# Altium project servo-27.PrjPcb
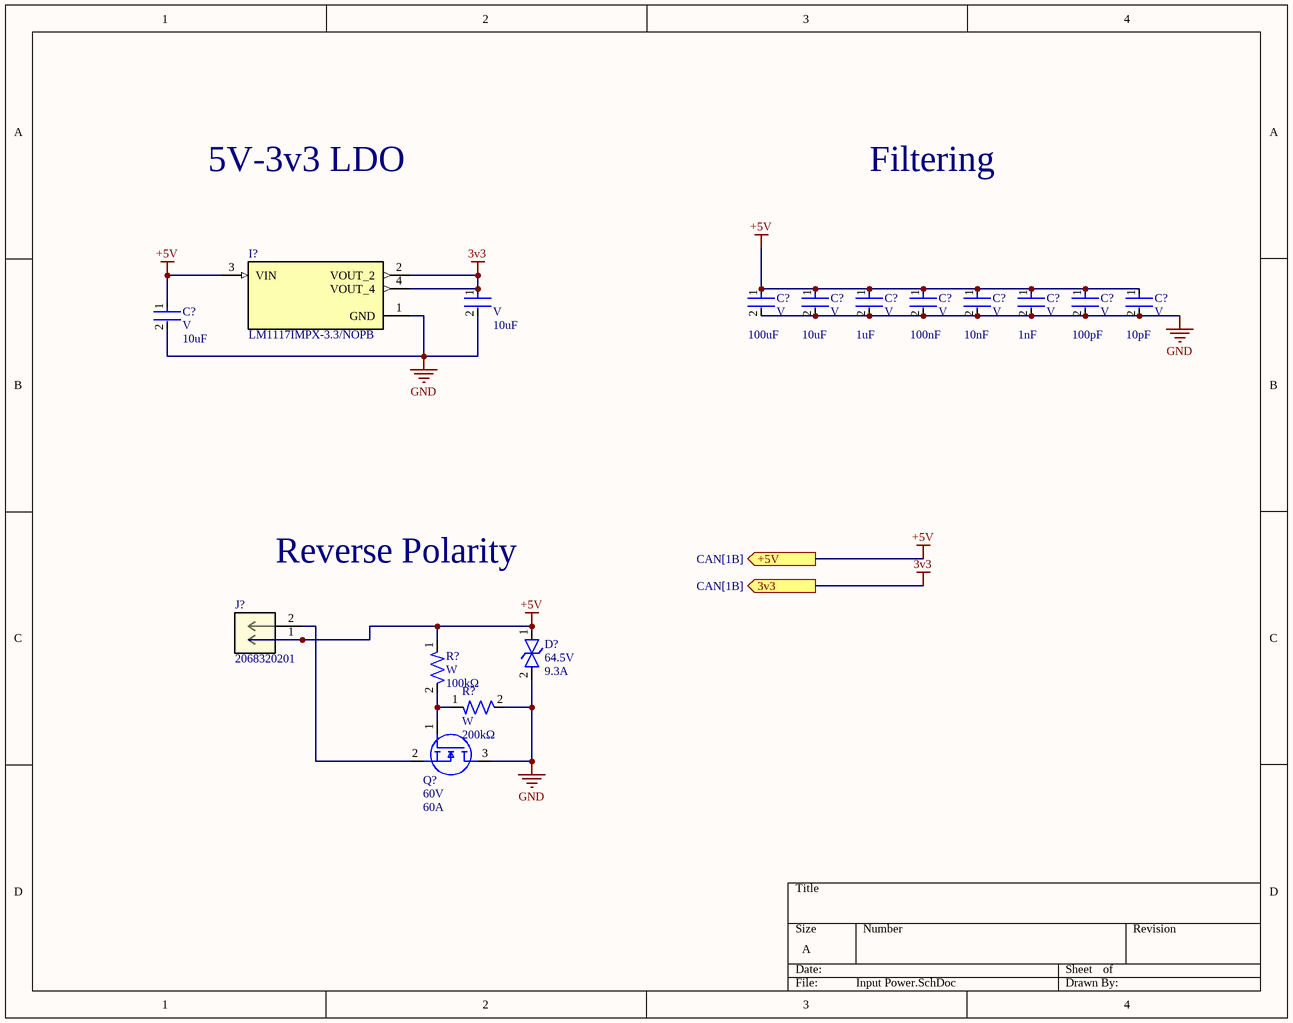
[diagram p0: Input Power.SchDoc]
4 sheets, 32 parts. Net scope: flat (ports and power ports of the same name join across sheets).
Sheets:
  Input Power.SchDoc
  CAN.SchDoc
  MCU.SchDoc
  Headers.SchDoc

## Sheet Input Power.SchDoc
size A; SheetNumber: 1; SheetTotal: 4

### Parts
(Parts that share a designator on the sheet are numbered #1, #2 ... from top to bottom, then left to right.)
?  Voltage Rating: V  Capacitance: 10uF  [CAP-0603]  (hidden comment: CAP 0603)
C?#1  Voltage Rating: V  Capacitance: 100uF  [CAP-0603]  (hidden comment: CAP 0603)
C?#2  Voltage Rating: V  Capacitance: 10uF  [CAP-0603]  (hidden comment: CAP 0603)
C?#3  Voltage Rating: V  Capacitance: 1uF  [CAP-0603]  (hidden comment: CAP 0603)
C?#4  Voltage Rating: V  Capacitance: 100nF  [CAP-0603]  (hidden comment: CAP 0603)
C?#5  Voltage Rating: V  Capacitance: 10nF  [CAP-0603]  (hidden comment: CAP 0603)
C?#6  Voltage Rating: V  Capacitance: 1nF  [CAP-0603]  (hidden comment: CAP 0603)
C?#7  Voltage Rating: V  Capacitance: 100pF  [CAP-0603]  (hidden comment: CAP 0603)
C?#8  Voltage Rating: V  Capacitance: 10pF  [CAP-0603]  (hidden comment: CAP 0603)
C?#9  Voltage Rating: V  Capacitance: 10uF  [CAP-0603]  (hidden comment: CAP 0603)
D?#1  Voltage Rating: 64.5V  Current Rating: 9.3A  [DO-214AA (SMBJ)]  (hidden comment: SMBJ40CA)
I?  LM1117IMPX-3.3/NOPB  [IC-SOT-223-4]
J?#1  2068320201  [CONN_2068320000-SD_02_MOL]
Q?#1  Voltage: 60V  Continuous Current: 60A  [IC-8VSONCLIP]  (hidden comment: CSD18543Q3AT)
R?#1  Wattage: W  Resistance: 100kΩ  [RES-0603]  (hidden comment: RES 0603)
R?#2  Wattage: W  Resistance: 200kΩ  [RES-0603]  (hidden comment: RES 0603)

### Ports
3v3 (out, see CAN[1B]), +5V (out, see CAN[1B])

### Nets
3v3: ?.1 I?.2(VOUT_2) I?.4(VOUT_4) ; port 3v3  [project net VBAT]
+5V: C?#1.1 C?#2.1 C?#3.1 C?#4.1 C?#5.1 C?#6.1 C?#7.1 C?#8.1 C?#9.1 D?#1.1 I?.3(VIN) J?#1.1 R?#1.1 ; port +5V
GND: ?.2 C?#1.2 C?#2.2 C?#3.2 C?#4.2 C?#5.2 C?#6.2 C?#7.2 C?#8.2 C?#9.2 D?#1.2 I?.1(GND) Q?#1.3(D) R?#2.2
NetJ?#1_2: J?#1.2 Q?#1.2(S)
NetQ?#1_1: Q?#1.1(G) R?#1.2 R?#2.1

### Notes on the sheet
- 5V-3v3 LDO
- Filtering
- Reverse Polarity

### Library data of the parts
? C?#9 = CAP 0603: 10u
D?#1 = DIO-TVS-0001: TVS DIODE 40VWM 64.5VC DO214AA; ComponentLink1Description: Datasheet; ComponentLink1URL: https://www.littelfuse.com/media?resourcetype=datasheets&itemid=09a6ae9a-73cb-4ac4-acac-e6dab92ab953&filename=littelfuse_tvs_diode_smbj_datasheet.pdf
I? = IC_LDO_3V3_0001: IC REG LIN 3.3V 800MA SOT223-4; ComponentLink1Description: New link; ComponentLink1URL: https://www.ti.com/lit/ds/symlink/lm1117.pdf?HQS=dis-dk-null-digikeymode-dsf-pf-null-wwe&ts=1721700739746
J?#1 = CONN MF+ 2 PIN VERT: Micro-Fit+ Vertical Header, Through Hole, 3.00mm Pitch, Dual Row, 2 Circuits, Tin (Sn) Plating, Glow-Wire Capable, Black, Tray; Manufacturer_Name: Molex Connector Corporation; Copyright: Copyright (C) 2025 Ultra Librarian. All rights reserved.; Manufacturer_Part_Number: 2068320201; RefDes: RefDes; Type: Type
Q?#1 = NMOS-60A-0001: MOSFET N-CH 60V 12A/60A 8VSON; ComponentLink2Description: Datasheet; ComponentLink2URL: http://www.ti.com/lit/ds/symlink/csd18543q3a.pdf
R?#1 = RES 0603: 100

## Sheet CAN.SchDoc
size A; SheetNumber: 2; SheetTotal: 4
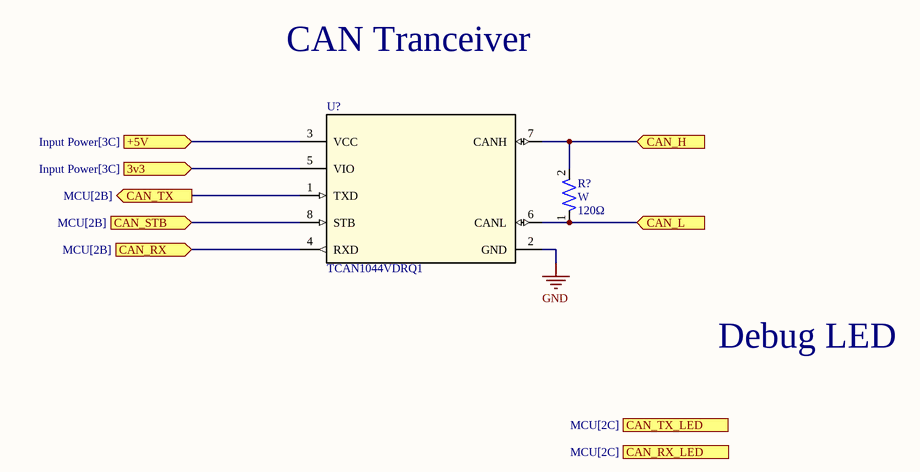
[diagram p1: CAN.SchDoc]

### Parts
(Parts that share a designator on the sheet are numbered #1, #2 ... from top to bottom, then left to right.)
R?#3  Wattage: W  Resistance: 120Ω  [RES-0603]  (hidden comment: RES 0603)
U?#1  TCAN1044VDRQ1  [IC-8SOIC]

### Ports
3v3 (in, see Input Power[3C]), +5V (in, see Input Power[3C]), CAN_H (in), CAN_L (in), CAN_RX (in, see MCU[2B]), CAN_RX_LED (see MCU[2C]), CAN_STB (in, see MCU[2B]), CAN_TX (out, see MCU[2B]), CAN_TX_LED (see MCU[2C])

### Nets
+5V: U?#1.3(VCC) ; port +5V
GND: U?#1.2(GND)
VBAT: U?#1.5(VIO) ; port 3v3
NetR?#3_1: R?#3.1 U?#1.6(CANL) ; port CAN_L
NetR?#3_2: R?#3.2 U?#1.7(CANH) ; port CAN_H
NetU?#1_1: U?#1.1(TXD) ; port CAN_TX
NetU?#1_4: U?#1.4(RXD) ; port CAN_RX
NetU?#1_8: U?#1.8(STB) ; port CAN_STB

### Notes on the sheet
- CAN Tranceiver
- Debug LED

### Library data of the parts
U?#1 = IC-CAN-0001: IC TRANSCEIVER 1/1 8SOIC; ComponentLink1Description: Datasheet; ComponentLink1URL: https://www.ti.com/lit/ds/symlink/tcan1044-q1.pdf?HQS=dis-dk-null-digikeymode-dsf-pf-null-wwe&ts=1728758303289&ref_url=https%253A%252F%252Fwww.ti.com%252Fgeneral%252Fdocs%252Fsuppproductinfo.tsp%253FdistId%253D10%2526gotoUrl%253Dhttps%253A%252F%252Fwww.ti.com%252Flit%252Fgpn%252Ftcan1044-q1

## Sheet MCU.SchDoc
size A; SheetNumber: 3; SheetTotal: 4
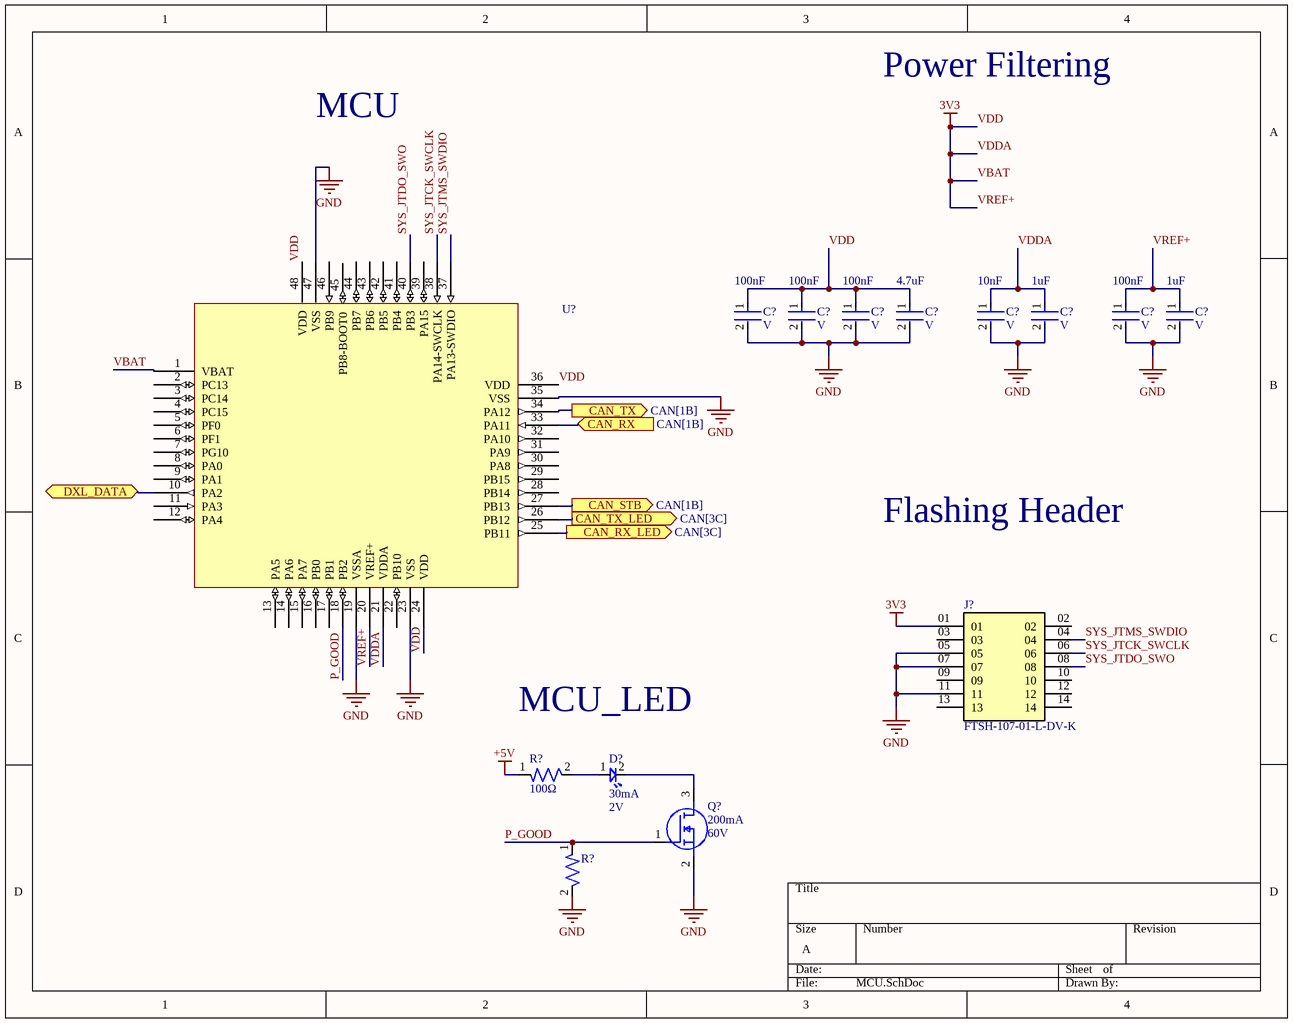
[diagram p2: MCU.SchDoc]

### Parts
(Parts that share a designator on the sheet are numbered #1, #2 ... from top to bottom, then left to right.)
C?#10  Voltage Rating: V  Capacitance: 100nF  [CAP-0603]  (hidden comment: CAP 0603)
C?#11  Voltage Rating: V  Capacitance: 100nF  [CAP-0603]  (hidden comment: CAP 0603)
C?#12  Voltage Rating: V  Capacitance: 100nF  [CAP-0603]  (hidden comment: CAP 0603)
C?#13  Voltage Rating: V  Capacitance: 4.7uF  [CAP-0603]  (hidden comment: CAP 0603)
C?#14  Voltage Rating: V  Capacitance: 10nF  [CAP-0603]  (hidden comment: CAP 0603)
C?#15  Voltage Rating: V  Capacitance: 1uF  [CAP-0603]  (hidden comment: CAP 0603)
C?#16  Voltage Rating: V  Capacitance: 100nF  [CAP-0603]  (hidden comment: CAP 0603)
C?#17  Voltage Rating: V  Capacitance: 1uF  [CAP-0603]  (hidden comment: CAP 0603)
D?#2  Forward Current: 30mA  Forward Voltage: 2V  [LED-0603]  (hidden comment: BL-HKC36G-AV-TRB)
J?#2  FTSH-107-01-L-DV-K  [SAMTEC_FTSH-107-01-L-DV-K]
Q?#2  Continuous Current: 200mA  Voltage: 60V  [IC-SOT23-3]  (hidden comment: T2N7002AK,LM)
R?#4  Resistance: 100Ω  [RES-2010]  (hidden comment: CRF2010-J/-000ELF)
R?#5  CRF2010-J/-000ELF  [RES-2010]  (value not drawn)
U?#2  STM32G431CBT6  [IC-LQFP48]  (value not drawn)

### Ports
CAN_RX (in, see CAN[1B]), CAN_RX_LED (out, see CAN[3C]), CAN_STB (out, see CAN[1B]), CAN_TX (out, see CAN[1B]), CAN_TX_LED (out, see CAN[3C]), DXL_DATA (bidir)

### Nets
+5V: R?#4.1
GND: C?#10.2 C?#11.2 C?#12.2 C?#13.2 C?#14.2 C?#15.2 C?#16.2 C?#17.2 J?#2.05 J?#2.07 J?#2.11 Q?#2.2(S) R?#5.2 U?#2.19(VSSA) U?#2.23(VSS) U?#2.35(VSS) U?#2.47(VSS)
VBAT: C?#10.1 C?#11.1 C?#12.1 C?#13.1 C?#14.1 C?#15.1 C?#16.1 C?#17.1 J?#2.01 U?#2.1(VBAT) U?#2.20(VREF+) U?#2.21(VDDA) U?#2.24(VDD) U?#2.36(VDD) U?#2.48(VDD)  [also labelled 3V3, VDD, VDDA, VREF+]
P_GOOD: Q?#2.1(G) R?#5.1 U?#2.18(PB2)
SYS_JTCK_SWCLK: J?#2.06 U?#2.38(PA14-SWCLK)
SYS_JTDO_SWO: J?#2.08 U?#2.40(PB3)
SYS_JTMS_SWDIO: J?#2.04 U?#2.37(PA13-SWDIO)
NetD?#2_1: D?#2.1 R?#4.2
NetD?#2_2: D?#2.2 Q?#2.3(D)
NetU?#1_1: U?#2.34(PA12) ; port CAN_TX
NetU?#1_4: U?#2.33(PA11) ; port CAN_RX
NetU?#1_8: U?#2.27(PB13) ; port CAN_STB
NetU?#2_10: U?#2.10(PA2) ; port DXL_DATA
NetU?#2_25: U?#2.25(PB11) ; port CAN_RX_LED
NetU?#2_26: U?#2.26(PB12) ; port CAN_TX_LED

Not connected (* = marked no-connect by the designer): J?#2 02 03 09 10 12 13 14; U?#2 2(PC13) 3(PC14) 4(PC15) 5(PF0) 6(PF1) 7(PG10) 8(PA0) 9(PA1) 11(PA3) 12(PA4) 13(PA5) 14(PA6) 15(PA7) 16(PB0) 17(PB1) 22(PB10) 28(PB14) 29(PB15) 30(PA8) 31(PA9) 32(PA10) 39(PA15) 41(PB4) 42(PB5) 43(PB6) 44(PB7) 45(PB8-BOOT0) 46(PB9)

### Notes on the sheet
- Power Filtering
- MCU
- Flashing Header
- MCU_LED

### Library data of the parts
D?#2 = LED-0001: LED YELLOW CLEAR 0603 SMD; ComponentLink1Description: Datasheet; ComponentLink1URL: https://www.americanbrightled.com/pdffiles/led-components/smt/BL-HKC36G-AV-TRB.pdf
J?#2 = CONN_Flashing-0001: Connector Header Surface Mount 14 position 0.050" (1.27mm); MF: Samtec; Value: *; Price: None; Package: None; Availability: Unavailable; MP: FTSH-107-01-L-DV-K; ComponentLink1Description: Datasheet; ComponentLink1URL: https://mm.digikey.com/Volume0/opasdata/d220001/medias/docus/6209/ftsh-1xx-xx-xxx-dv-xxx-xxx-x-xx-mkt.pdf
Q?#2 = NMOS-200MA-0001: MOSFET N-CH 60V 200MA SOT23; ComponentLink1Description: Datasheet; ComponentLink1URL: https://toshiba.semicon-storage.com/info/T2N7002AK_datasheet_en_20150401.pdf?did=29712&prodName=T2N7002AK
R?#4 R?#5 = RES-0-0001: 0 Ohms Jumper Chip Resistor 2010 (5025 Metric) Automotive AEC-Q200 Metal Element; Tolerance: 1%; Size: 0402; ComponentLink1Description: Datasheet; ComponentLink1URL: https://www.yageo.com/upload/media/product/products/datasheet/rchip/PYu-RC_Group_51_RoHS_L_12.pdf
U?#2 = IC-STM32G431CBT6: IC MCU 32BIT 128KB FLASH 48LQFP; Package: 48LQFP; ComponentLink1Description: Datasheet; ComponentLink1URL: https://www.st.com/resource/en/datasheet/stm32g431cb.pdf

## Sheet Headers.SchDoc
size A; SheetNumber: 4; SheetTotal: 4

## Nets that join several sheets
+5V: Input Power (13 pins), CAN (U?#1.3), MCU (R?#4.1)
GND: Input Power (14 pins), CAN (U?#1.2), MCU (17 pins)
VBAT: Input Power (?.1 I?.2 I?.4), CAN (U?#1.5), MCU (15 pins)
NetU?#1_1: CAN (U?#1.1), MCU (U?#2.34)
NetU?#1_4: CAN (U?#1.4), MCU (U?#2.33)
NetU?#1_8: CAN (U?#1.8), MCU (U?#2.27)